# Altium project Multi_Interface_Hub_Pro_v1.0.PrjPcb (part 3 of 3)

## Sheet Gbe_Ethernet.SchDoc
size A3; SheetNumber: 1; SheetTotal: 4
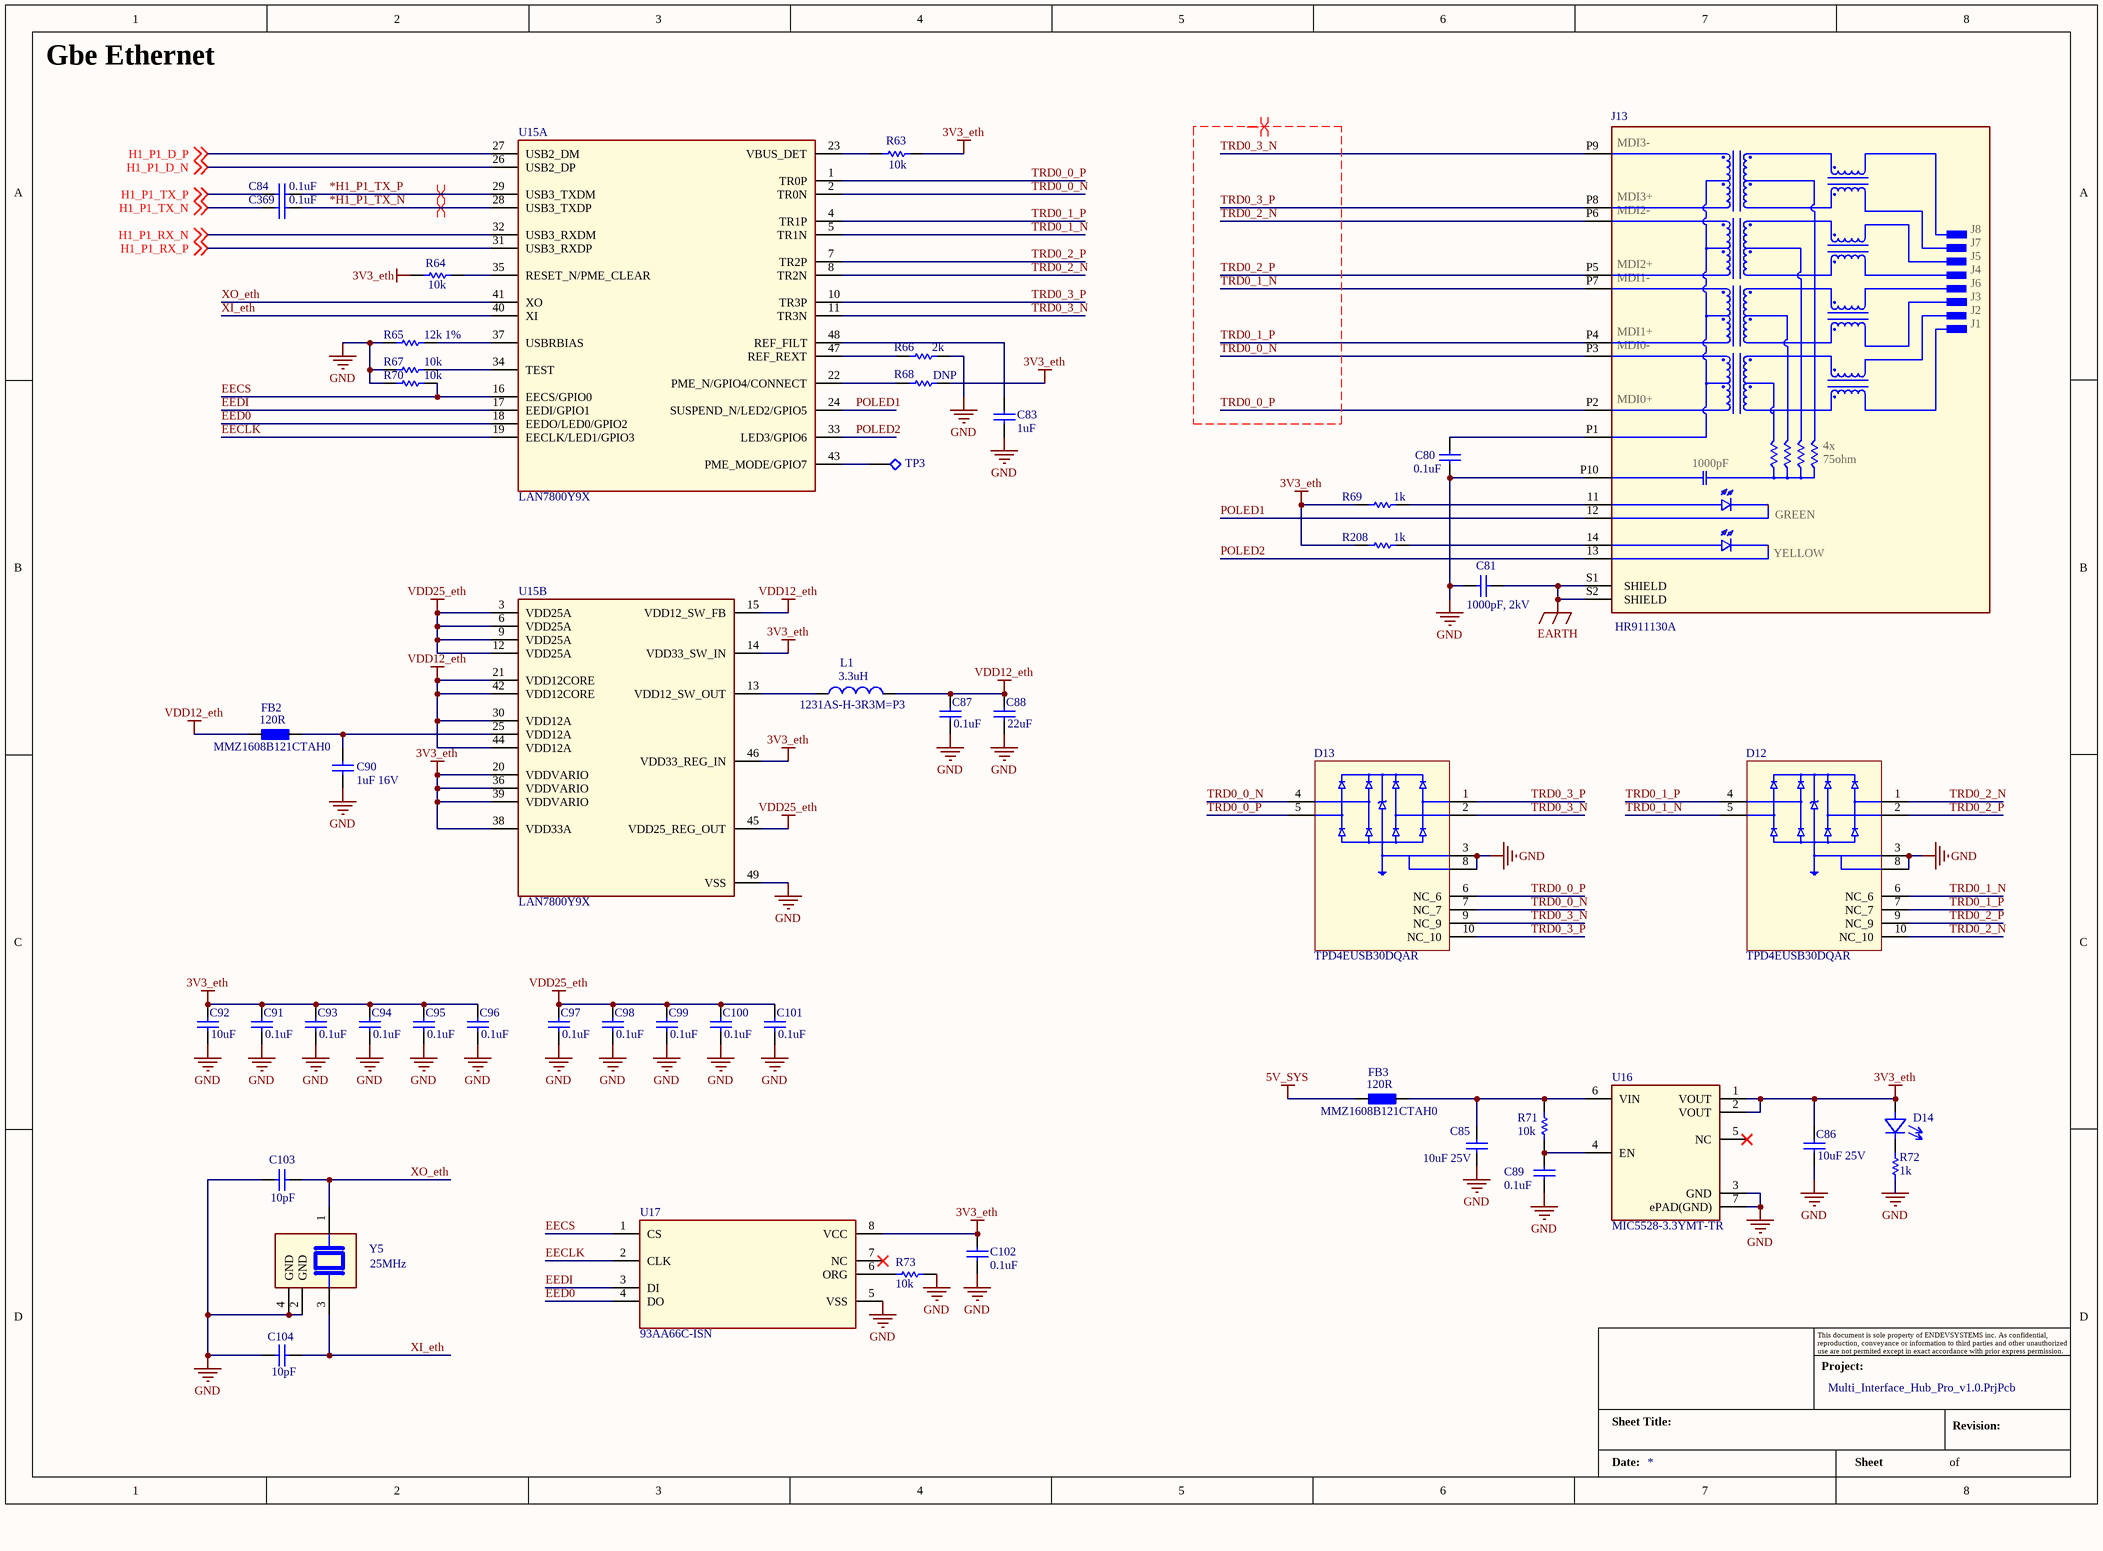
[diagram p10: Gbe_Ethernet.SchDoc]

### Parts
(Parts that share a designator on the sheet are numbered #1, #2 ... from top to bottom, then left to right.)
?#11  Project:: Multi_Interface_Hub_Pro_v1.0.PrjPcb  (hidden comment: Title_Block)  (graphical)
C80  0.1uF  [C-0402/1005]
C81  value 1000pF, 2kV  [C-0402/1005]  (hidden comment: 0.1uF)
C83  1uF  [C-0402/1005]
C84  0.1uF  [C-0402/1005]
C85  value 10uF 25V  [C-0402/1005]  (hidden comment: 0.1uF)
C86  value 10uF 25V  [C-0402/1005]  (hidden comment: 0.1uF)
C87  0.1uF  [C-0402/1005]
C88  22uF  [C-0402/1005]
C89  0.1uF  [C-0402/1005]
C90  1uF 16V  [C-0402/1005]
C91  0.1uF  [C-0402/1005]
C92  value 10uF  [C-0402/1005]  (hidden comment: 10uF 25V)
C93  0.1uF  [C-0402/1005]
C94  0.1uF  [C-0402/1005]
C95  0.1uF  [C-0402/1005]
C96  0.1uF  [C-0402/1005]
C97  0.1uF  [C-0402/1005]
C98  0.1uF  [C-0402/1005]
C99  0.1uF  [C-0402/1005]
C100  0.1uF  [C-0402/1005]
C101  0.1uF  [C-0402/1005]
C102  0.1uF  [C-0402/1005]
C103  10pF  [R-0402/1005]
C104  10pF  [R-0402/1005]
C369  0.1uF  [C-0402/1005]
D12  TPD4EUSB30DQAR  [IC_TPD4EUSB30DQAR]
D13  TPD4EUSB30DQAR  [IC_TPD4EUSB30DQAR]
D14  BRIGHT GREEN  [LEDC1608X65N]  (value not drawn)
FB2  MMZ1608B121CTAH0  value 120R  [R-0603/1608]
FB3  MMZ1608B121CTAH0  value 120R  [R-0603/1608]
J13  HR911130A  [HANRUN_HR911130A]
L1  1231AS-H-3R3M=P3  value 3.3uH  [0402-A]
R63  10k  [R-0402/1005]
R64  10k  [R-0402/1005]
R65  12k 1%  [R-0402/1005]
R66  2k  [R-0402/1005]
R67  10k  [R-0402/1005]
R68  DNP  [R-0402/1005]
R69  1k  [R-0402/1005]
R70  10k  [R-0402/1005]
R71  10k  [R-0402/1005]
R72  1k  [R-0402/1005]
R73  10k  [R-0402/1005]
R208  1k  [R-0402/1005]
TP3  Test Points  [Test Point TH Round H0.9,D1.6]  (value not drawn)
U15  LAN7800Y9X  [SQFN48_7X7_Y9X_MCH]  (parts A,B of 2)
U16  MIC5528-3.3YMT-TR  [SON40P120X120X60-7N]
U17  93AA66C-ISN  [SOIC8-N_MC_MCH]
Y5  value 25MHz  [ECS-250-10-37B2]  (hidden comment: ECS-250-10-37B2-CKM-TR)

### Nets
3V3_eth: C86.2 C91.2 C92.2 C93.2 C94.2 C95.2 C96.2 C102.2 D14.A R63.1 R64.1 R68.1 R69.1 R208.1 U15.14(VDD33_SW_IN) U15.20(VDDVARIO) U15.36(VDDVARIO) U15.38(VDD33A) U15.39(VDDVARIO) U15.46(VDD33_REG_IN) U16.1(VOUT) U16.2(VOUT) U17.8(VCC)
5V_SYS: FB3.2
EARTH: C81.2 J13.S1(SHIELD) J13.S2(SHIELD)
GND: C80.2 C81.1 C83.2 C85.1 C86.1 C87.1 C88.1 C89.1 C90.2 C91.1 C92.1 C93.1 C94.1 C95.1 C96.1 C97.1 C98.1 C99.1 C100.1 C101.1 C102.1 C103.2 C104.2 D12.3(GND_3) D12.8(GND_8) D13.3(GND_3) D13.8(GND_8) J13.P10 R65.2 R66.1 R67.2 R70.2 R72.2 R73.2 U15.49(VSS) U16.3(GND) U16.7(ePAD(GND)) U17.5(VSS) Y5.2(GND) Y5.4(GND)
VDD12_eth: C87.2 C88.2 FB2.2 L1.2 U15.15(VDD12_SW_FB) U15.21(VDD12CORE) U15.30(VDD12A) U15.42(VDD12CORE) U15.44(VDD12A)
VDD25_eth: C97.2 C98.2 C99.2 C100.2 C101.2 U15.3(VDD25A) U15.6(VDD25A) U15.9(VDD25A) U15.12(VDD25A) U15.45(VDD25_REG_OUT)
*H1_P1_TX_N: C369.1 U15.28(USB3_TXDP)
*H1_P1_TX_P: C84.1 U15.29(USB3_TXDM)
EECLK: U15.19(EECLK/LED1/GPIO3) U17.2(CLK)
EECS: R70.1 U15.16(EECS/GPIO0) U17.1(CS)
EED0: U15.18(EEDO/LED0/GPIO2) U17.4(DO)
EEDI: U15.17(EEDI/GPIO1) U17.3(DI)
H1_P1_D_N: U15.26(USB2_DP) ; off-sheet H1_P1_D_N
H1_P1_D_P: U15.27(USB2_DM) ; off-sheet H1_P1_D_P
H1_P1_RX_N: U15.32(USB3_RXDM) ; off-sheet H1_P1_RX_N
H1_P1_RX_P: U15.31(USB3_RXDP) ; off-sheet H1_P1_RX_P
H1_P1_TX_N: C369.2 ; off-sheet H1_P1_TX_N
H1_P1_TX_P: C84.2 ; off-sheet H1_P1_TX_P
POLED1: J13.12 U15.24(SUSPEND_N/LED2/GPIO5)
POLED2: J13.13 U15.33(LED3/GPIO6)
TRD0_0_N: D13.4(D2+) D13.7(NC_7) J13.P3 U15.2(TR0N)
TRD0_0_P: D13.5(D2-) D13.6(NC_6) J13.P2 U15.1(TR0P)
TRD0_1_N: D12.5(D2-) D12.6(NC_6) J13.P7 U15.5(TR1N)
TRD0_1_P: D12.4(D2+) D12.7(NC_7) J13.P4 U15.4(TR1P)
TRD0_2_N: D12.1(D1+) D12.10(NC_10) J13.P6 U15.8(TR2N)
TRD0_2_P: D12.2(D1-) D12.9(NC_9) J13.P5 U15.7(TR2P)
TRD0_3_N: D13.2(D1-) D13.9(NC_9) J13.P9 U15.11(TR3N)
TRD0_3_P: D13.1(D1+) D13.10(NC_10) J13.P8 U15.10(TR3P)
XI_eth: C104.1 U15.40(XI) Y5.3
XO_eth: C103.1 U15.41(XO) Y5.1
NetC80_1: C80.1 J13.P1
NetC83_1: C83.1 U15.48(REF_FILT)
NetC85_2: C85.2 FB3.1 R71.1 U16.6(VIN)
NetC89_2: C89.2 R71.2 U16.4(EN)
NetC90_1: C90.1 FB2.1 U15.25(VDD12A)
NetJ13_11: J13.11 R69.2
NetJ13_14: J13.14 R208.2
NetL1_1: L1.1 U15.13(VDD12_SW_OUT)
NetR63_2: R63.2 U15.23(VBUS_DET)
NetR64_2: R64.2 U15.35(RESET_N/PME_CLEAR)
NetR65_1: R65.1 U15.37(USBRBIAS)
NetR66_2: R66.2 U15.47(REF_REXT)
NetR67_1: R67.1 U15.34(TEST)
NetR68_2: R68.2 U15.22(PME_N/GPIO4/CONNECT)
NetR73_1: R73.1 U17.6(ORG)
NetTP3_1: TP3.1 U15.43(PME_MODE/GPIO7)

Not connected (* = marked no-connect by the designer): D14 C; R72 1; U16 5(NC)*; U17 7(NC)*

### Layout directives
differential pair; differential pair class Diff_100R: TRD0_0_N, TRD0_0_P, TRD0_1_N, TRD0_1_P, TRD0_2_N, TRD0_2_P, TRD0_3_N, TRD0_3_P
differential pair; differential pair class Diff_90R: *H1_P1_TX_N, *H1_P1_TX_P

### Notes on the sheet
- Gbe Ethernet
- (in symbol Title_Block) This document is sole property of ENDEVSYSTEMS inc. As confidential, reproduction, conveyance or information to third parties and other unauthorized use are not permited except in exact accordance with prior express permission.; Project:; Sheet Title:; Revision:; Date:; Sheet; of

### Library data of the parts
C80 C81 C84-C87 C89-C91 C93-C102 C369 = Cap: Capacitor; Published: 8-Jun-2000; LatestRevisionDate: 17-Jul-2002; LatestRevisionNote: Re-released for DXP Platform.; PackageReference: RAD-0.3; Publisher: Altium Limited; PackageDescription: Radial Cap, Thru-Hole; 2 Leads; 0.3 in Pin Spacing
  C80 C84 C87 C89 C91 C93-C102 C369: Value: 0.1uF
  C90: Value: 1uF 16V
C83 = Cap: 1uF 16V; Published: 8-Jun-2000; LatestRevisionDate: 17-Jul-2002; LatestRevisionNote: Re-released for DXP Platform.; PackageReference: RAD-0.3; Publisher: Altium Limited; PackageDescription: Radial Cap, Thru-Hole; 2 Leads; 0.3 in Pin Spacing; Value: 1uF
C88 = Cap: 22uF 6.3V; Published: 8-Jun-2000; LatestRevisionDate: 17-Jul-2002; LatestRevisionNote: Re-released for DXP Platform.; PackageReference: RAD-0.3; Publisher: Altium Limited; PackageDescription: Radial Cap, Thru-Hole; 2 Leads; 0.3 in Pin Spacing; Value: 22uF
C92 = Cap: Published: 8-Jun-2000; LatestRevisionDate: 17-Jul-2002; LatestRevisionNote: Re-released for DXP Platform.; PackageReference: RAD-0.3; Publisher: Altium Limited; PackageDescription: Radial Cap, Thru-Hole; 2 Leads; 0.3 in Pin Spacing
C103 C104 = Cap: Capacitor; Value: 0.1uF; Published: 8-Jun-2000; LatestRevisionDate: 17-Jul-2002; LatestRevisionNote: Re-released for DXP Platform.; PackageReference: RAD-0.3; Publisher: Altium Limited; PackageDescription: Radial Cap, Thru-Hole; 2 Leads; 0.3 in Pin Spacing
D12 D13 = TPD4EUSB30DQAR: 4-channel ESD solution for SuperSpeed (6 Gbps) USB 3.0 interface 10-USON -40 to 85; Value: *; Package: None; MP: TPD4EUSB30DQAR; Price: None; Availability: Unavailable
D14 = Diode-LED: Supplier: Digikey Electronics
FB2 FB3 = BLM15H: FERRITE BEAD 120 OHM 0402 1LN; Mfr. Part No.: BLM15HB121SN1D; Unit Price (USD): 0.19; Supplier Part No.: 490-4000-1-ND; Supplier: Digikey Electronics
J13 = HR911130A: Check availability; GateName_1: G$1; MF: hanrun; SymbolName_1: HR911130A; LibraryName: HR911130A; DeviceSetName: HR911130A; AVAILABILITY: Not in stock; MP: HR911130A; PACKAGE: None; PRICE: None; YELLOW: YELLOW; GREEN: GREEN; 75ohm: 75ohm; 1000pF: 1000pF; 4x: 4x; MDI3-: MDI3-; MDI3+: MDI3+; MDI2-: MDI2-; MDI2+: MDI2+; MDI1-: MDI1-; MDI1+: MDI1+; MDI0-: MDI0-; MDI0+: MDI0+; J8: J8; J7: J7; J5: J5; J4: J4; J6: J6; J3: J3; J2: J2; J1: J1
L1 = Inductor: Code_IEC: 1005; Published: 8-Jun-2000; LatestRevisionDate: 29-May-2009; LatestRevisionNote: IPC-7351 Footprint Added.; PackageReference: 0402-A; Publisher: Altium Limited; PackageDescription: Chip Inductor; Code_JEITA: 0402
R63 R64 R71 R73 = Res1: Resistor; Published: 8-Jun-2000; LatestRevisionDate: 17-Jul-2002; LatestRevisionNote: Re-released for DXP Platform.; PackageReference: AXIAL-0.3; Publisher: Altium Limited; PackageDescription: Axial Device, Thru-Hole; 2 Leads; 0.3 in Pin Spacing; Value: 10K
R65 R67 R70 = Res1: Resistor; Value: 200K; Published: 8-Jun-2000; LatestRevisionDate: 17-Jul-2002; LatestRevisionNote: Re-released for DXP Platform.; PackageReference: AXIAL-0.3; Publisher: Altium Limited; PackageDescription: Axial Device, Thru-Hole; 2 Leads; 0.3 in Pin Spacing
R66 R68 R69 R72 R208 = Res1: Resistor; Value: 10K; Published: 8-Jun-2000; LatestRevisionDate: 17-Jul-2002; LatestRevisionNote: Re-released for DXP Platform.; PackageReference: AXIAL-0.3; Publisher: Altium Limited; PackageDescription: Axial Device, Thru-Hole; 2 Leads; 0.3 in Pin Spacing
U15 = LAN7800Y9X: Ethernet Controller 10/100/1000 Base-TX PHY - Interface 48-SQFN (7x7); Mfr_Name: Microchip; RefDes: RefDes; Type: Type
U16 = MIC5528-3.3YMT-TR: IC REG LINEAR 3.3V 500MA 6TDFN; MF: Microchip; Package: TDFN-6 Microchip; MP: MIC5528-3.3YMT-TR; Value: *; SnapEDA_Link: https://www.snapeda.com/parts/MIC5528-3.3YMT-TR/Microchip/view-part/587087/?ref=snap; Price: None; Availability: Unavailable
U17 = 93AA66C-ISN: Microwire Serial EEPROM Family, 1.8 to 5.5V, 3 MHz, -40°Cto 125°C, SOIC-8, RoHS; Mfr_Name: Microchip; RefDes: RefDes; Type: Type
?#11 = Title_Block: Date:: *

## Sheet Audio_Codec.SchDoc
size A3; SheetNumber: 1; SheetTotal: 4
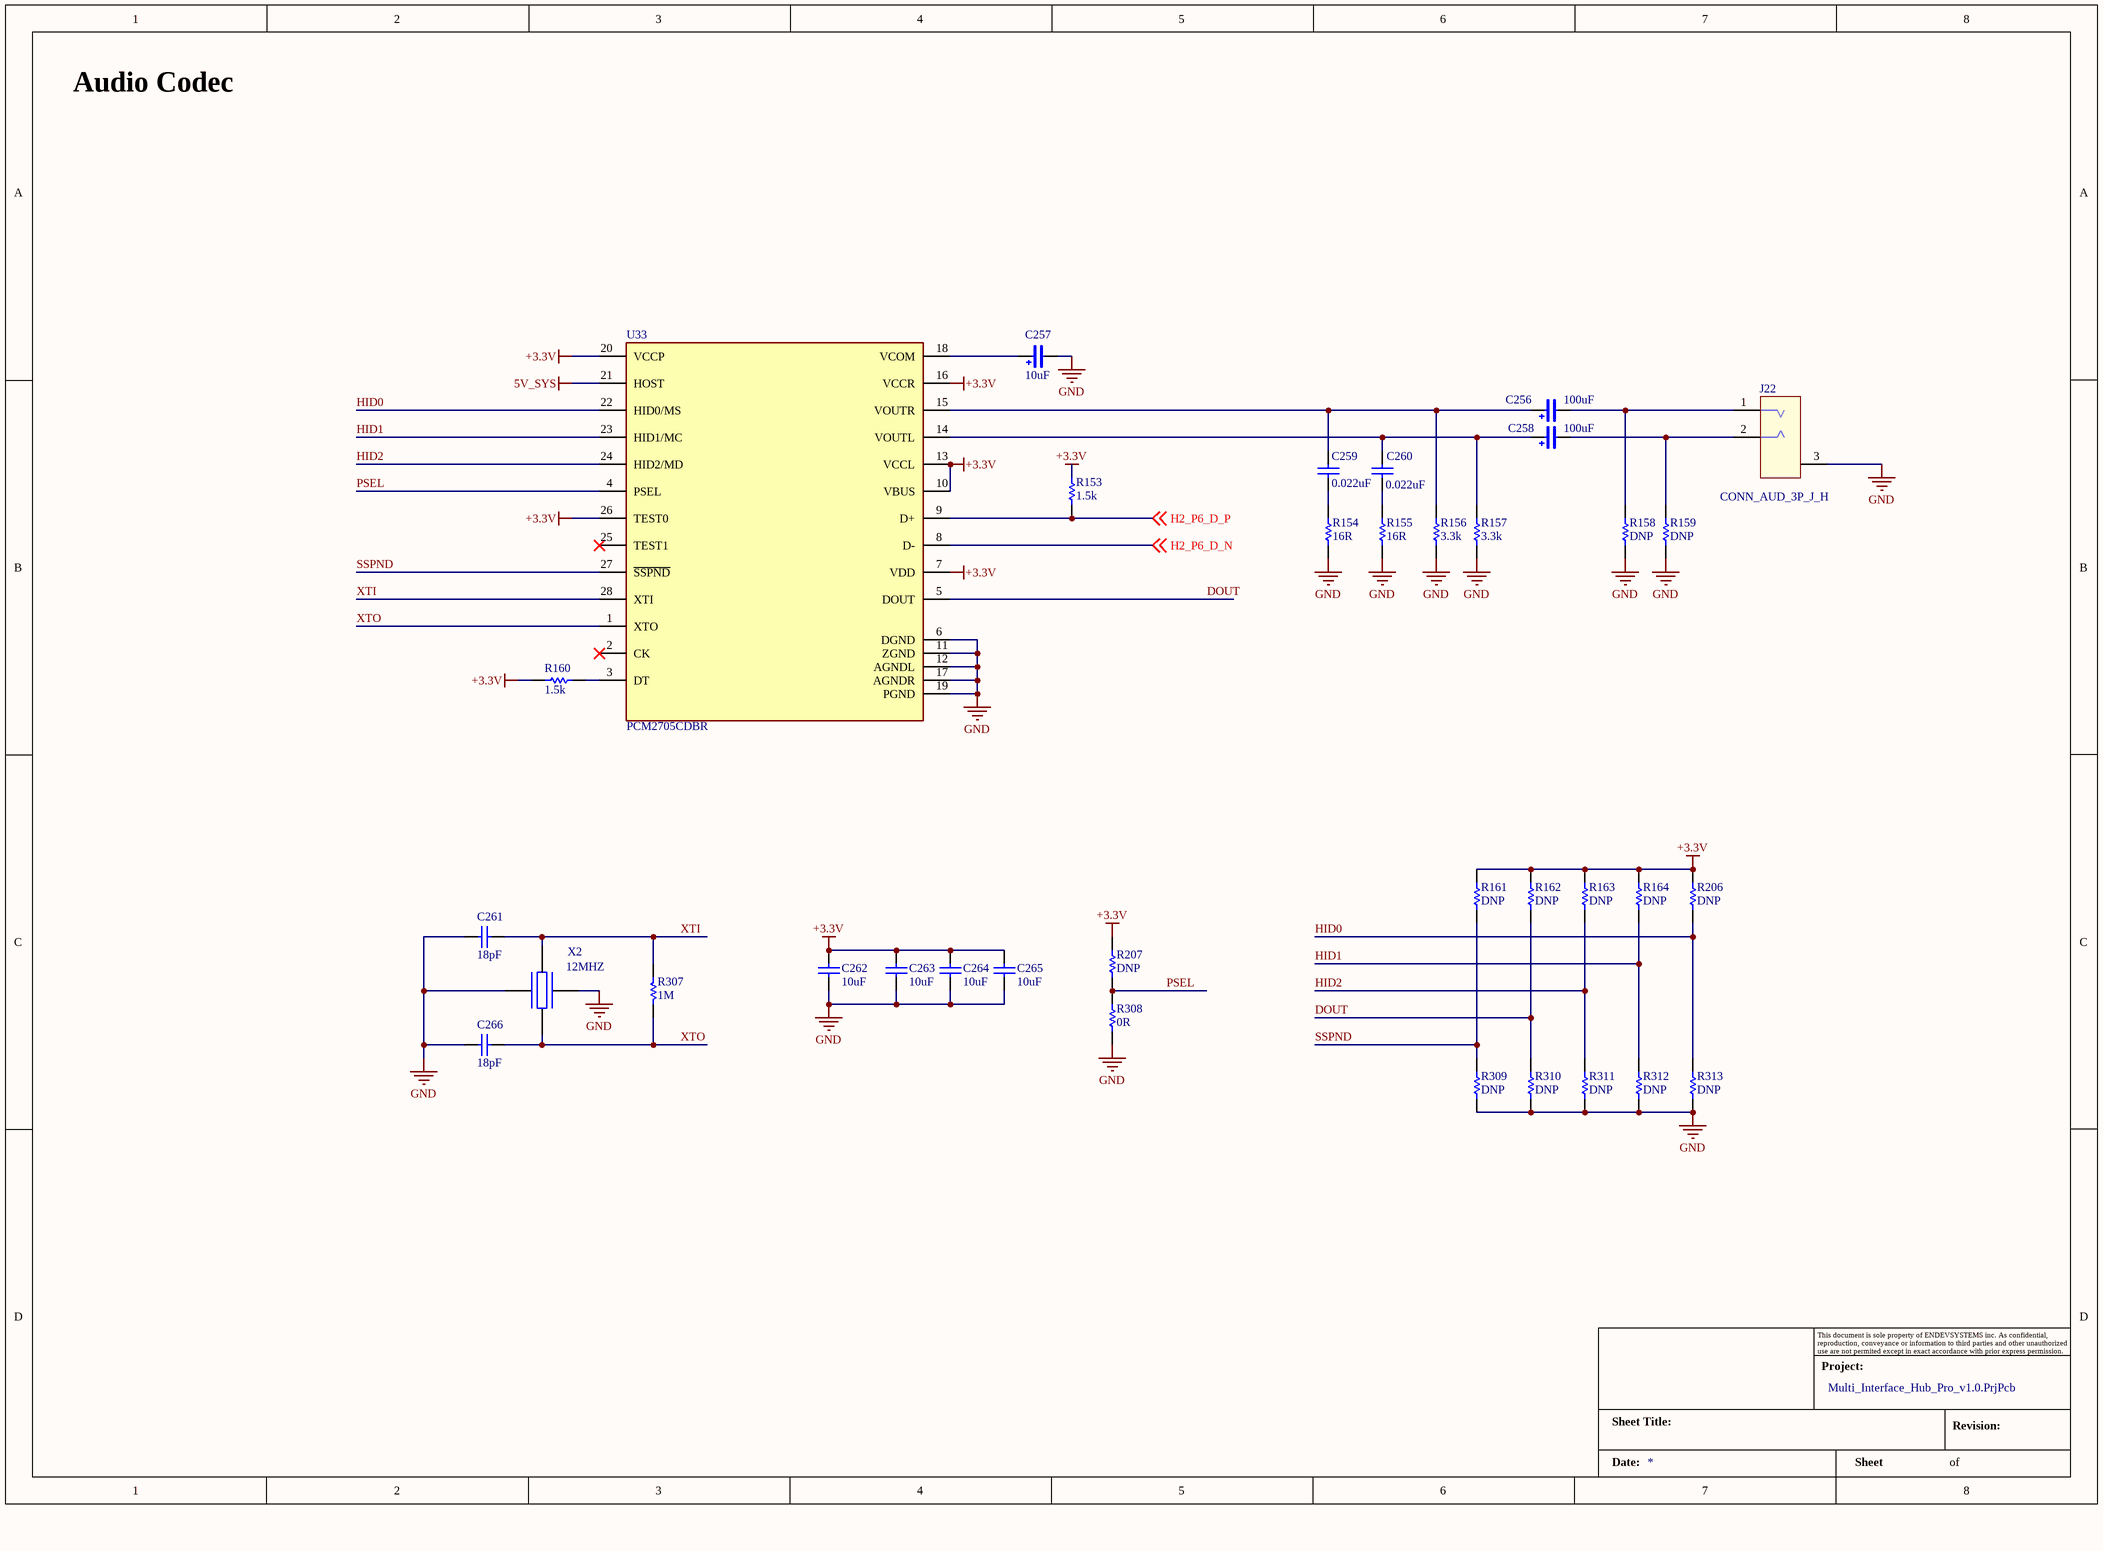
[diagram p11: Audio_Codec.SchDoc]

### Parts
(Parts that share a designator on the sheet are numbered #1, #2 ... from top to bottom, then left to right.)
?#12  Project:: Multi_Interface_Hub_Pro_v1.0.PrjPcb  (hidden comment: Title_Block)  (graphical)
C256  100uF  [C-1206 (Tantalum)]
C257  10uF  [C-1206 (Tantalum)]
C258  100uF  [C-1206 (Tantalum)]
C259  0.022uF  [CAP 1206/3216]
C260  0.022uF  [CAP 1206/3216]
C261  18pF  [CAP 1206/3216]
C262  10uF  [CAP 1206/3216]
C263  10uF  [CAP 1206/3216]
C264  10uF  [CAP 1206/3216]
C265  10uF  [CAP 1206/3216]
C266  18pF  [CAP 1206/3216]
J22  CONN_AUD_3P_J_H
R153  1.5k  [R-0402]
R154  16R  [R-0402]
R155  16R  [R-0402]
R156  3.3k  [R-0402]
R157  3.3k  [R-0402]
R158  DNP  [R-0402]
R159  DNP  [R-0402]
R160  1.5k  [R-0402]
R161  DNP  [R-0402]
R162  DNP  [R-0402]
R163  DNP  [R-0402]
R164  DNP  [R-0402]
R206  DNP  [R-0402]
R207  DNP  [R-0402]
R307  1M  [R-0402]
R308  0R  [R-0402]
R309  DNP  [R-0402]
R310  DNP  [R-0402]
R311  DNP  [R-0402]
R312  DNP  [R-0402]
R313  DNP  [R-0402]
U33  PCM2705CDBR  [SOP65P780X200-28N]
X2  12MHZ

### Nets
5V_SYS: U33.21(HOST)
+3.3V: C262.2 C263.2 C264.2 C265.2 R153.1 R160.1 R161.1 R162.1 R163.1 R164.1 R206.1 R207.1 U33.7(VDD) U33.10(VBUS) U33.13(VCCL) U33.16(VCCR) U33.20(VCCP) U33.26(TEST0)
GND: C257.- C261.2 C262.2 C263.2 C264.2 C265.2 C266.2 J22.3 R154.2 R155.2 R156.2 R157.2 R158.2 R159.2 R308.2 R309.1 R310.1 R311.1 R312.1 R313.1 U33.6(DGND) U33.11(ZGND) U33.12(AGNDL) U33.17(AGNDR) U33.19(PGND) X2.1(IN/OUT) X2.3(OUT/IN)
DOUT: R162.2 R310.2 U33.5(DOUT)
H2_P6_D_N: U33.8(D-) ; off-sheet H2_P6_D_N
H2_P6_D_P: R153.2 U33.9(D+) ; off-sheet H2_P6_D_P
HID0: R206.2 R313.2 U33.22(HID0/MS)
HID1: R164.2 R312.2 U33.23(HID1/MC)
HID2: R163.2 R311.2 U33.24(HID2/MD)
PSEL: R207.2 R308.1 U33.4(PSEL)
SSPND: R161.2 R309.2 U33.27(~{SSPND})
XTI: C261.2 R307.2 U33.28(XTI) X2.1(IN/OUT)
XTO: C266.2 R307.1 U33.1(XTO) X2.2(GND)
NetC256_+: C256.+ C259.2 R156.1 U33.15(VOUTR)
NetC256_-: C256.- J22.1 R158.1
NetC257_+: C257.+ U33.18(VCOM)
NetC258_+: C258.+ C260.2 R157.1 U33.14(VOUTL)
NetC258_-: C258.- J22.2 R159.1
NetC259_2: C259.2 R154.1
NetC260_2: C260.2 R155.1
NetR160_2: R160.2 U33.3(DT)

Not connected (* = marked no-connect by the designer): U33 2(CK)* 25(TEST1)*

### Notes on the sheet
- Audio Codec
- (in symbol Title_Block) This document is sole property of ENDEVSYSTEMS inc. As confidential, reproduction, conveyance or information to third parties and other unauthorized use are not permited except in exact accordance with prior express permission.; Project:; Sheet Title:; Revision:; Date:; Sheet; of

### Library data of the parts
C256-C258 = Capacitor-Polar: CAP TANT 10UF 10% 16V 1206; Mfr. Part No.: F931C106KAAAJ6; Unit Price (USD): 0.67; Value: 10uF 16V; Supplier Part No.: 478-10723-1-ND; Supplier: Digikey Electronics
C259-C266 = CAP 1206/3216: CAP CER 10UF 25V X5R 1206; Mfr. Part No.: C1206C106M3PACTU; Unit Price (USD): 0.28; Supplier Part No.: 399-8153-1-ND; Supplier: Digikey Electronics
R153-R164 R206 R207 R307-R313 = Resistor: RES SMD 51 OHM 0.5% 1/16W 0402; Mfr. Part No.: ERA-2AED510X; Value: 51R; Unit Price (USD): 0.21; Supplier Part No.: P51DECT-ND; Supplier: Digikey Electronics
U33 = PCM2705CDBR: 98dB SNR Stereo Full Speed DAC with line-out and S/PDIF output, Bus/Self-powered (S/W Control); MF: Texas Instruments; SnapEDA_Link: https://www.snapeda.com/parts/PCM2705CDBR/Texas+Instruments/view-part/?ref=snap; Package: SSOP-28 Texas Instruments; Value: *; MP: PCM2705CDBR; Check_prices: https://www.snapeda.com/parts/PCM2705CDBR/Texas+Instruments/view-part/?ref=eda
X2 = Crystal-4SMD: Mfr. Part No.: LIS2DHTR; Supplier: DigikeyElectronics
?#12 = Title_Block: Date:: *

## Sheet InputPower.SchDoc
size A3; SheetNumber: 1; SheetTotal: 4
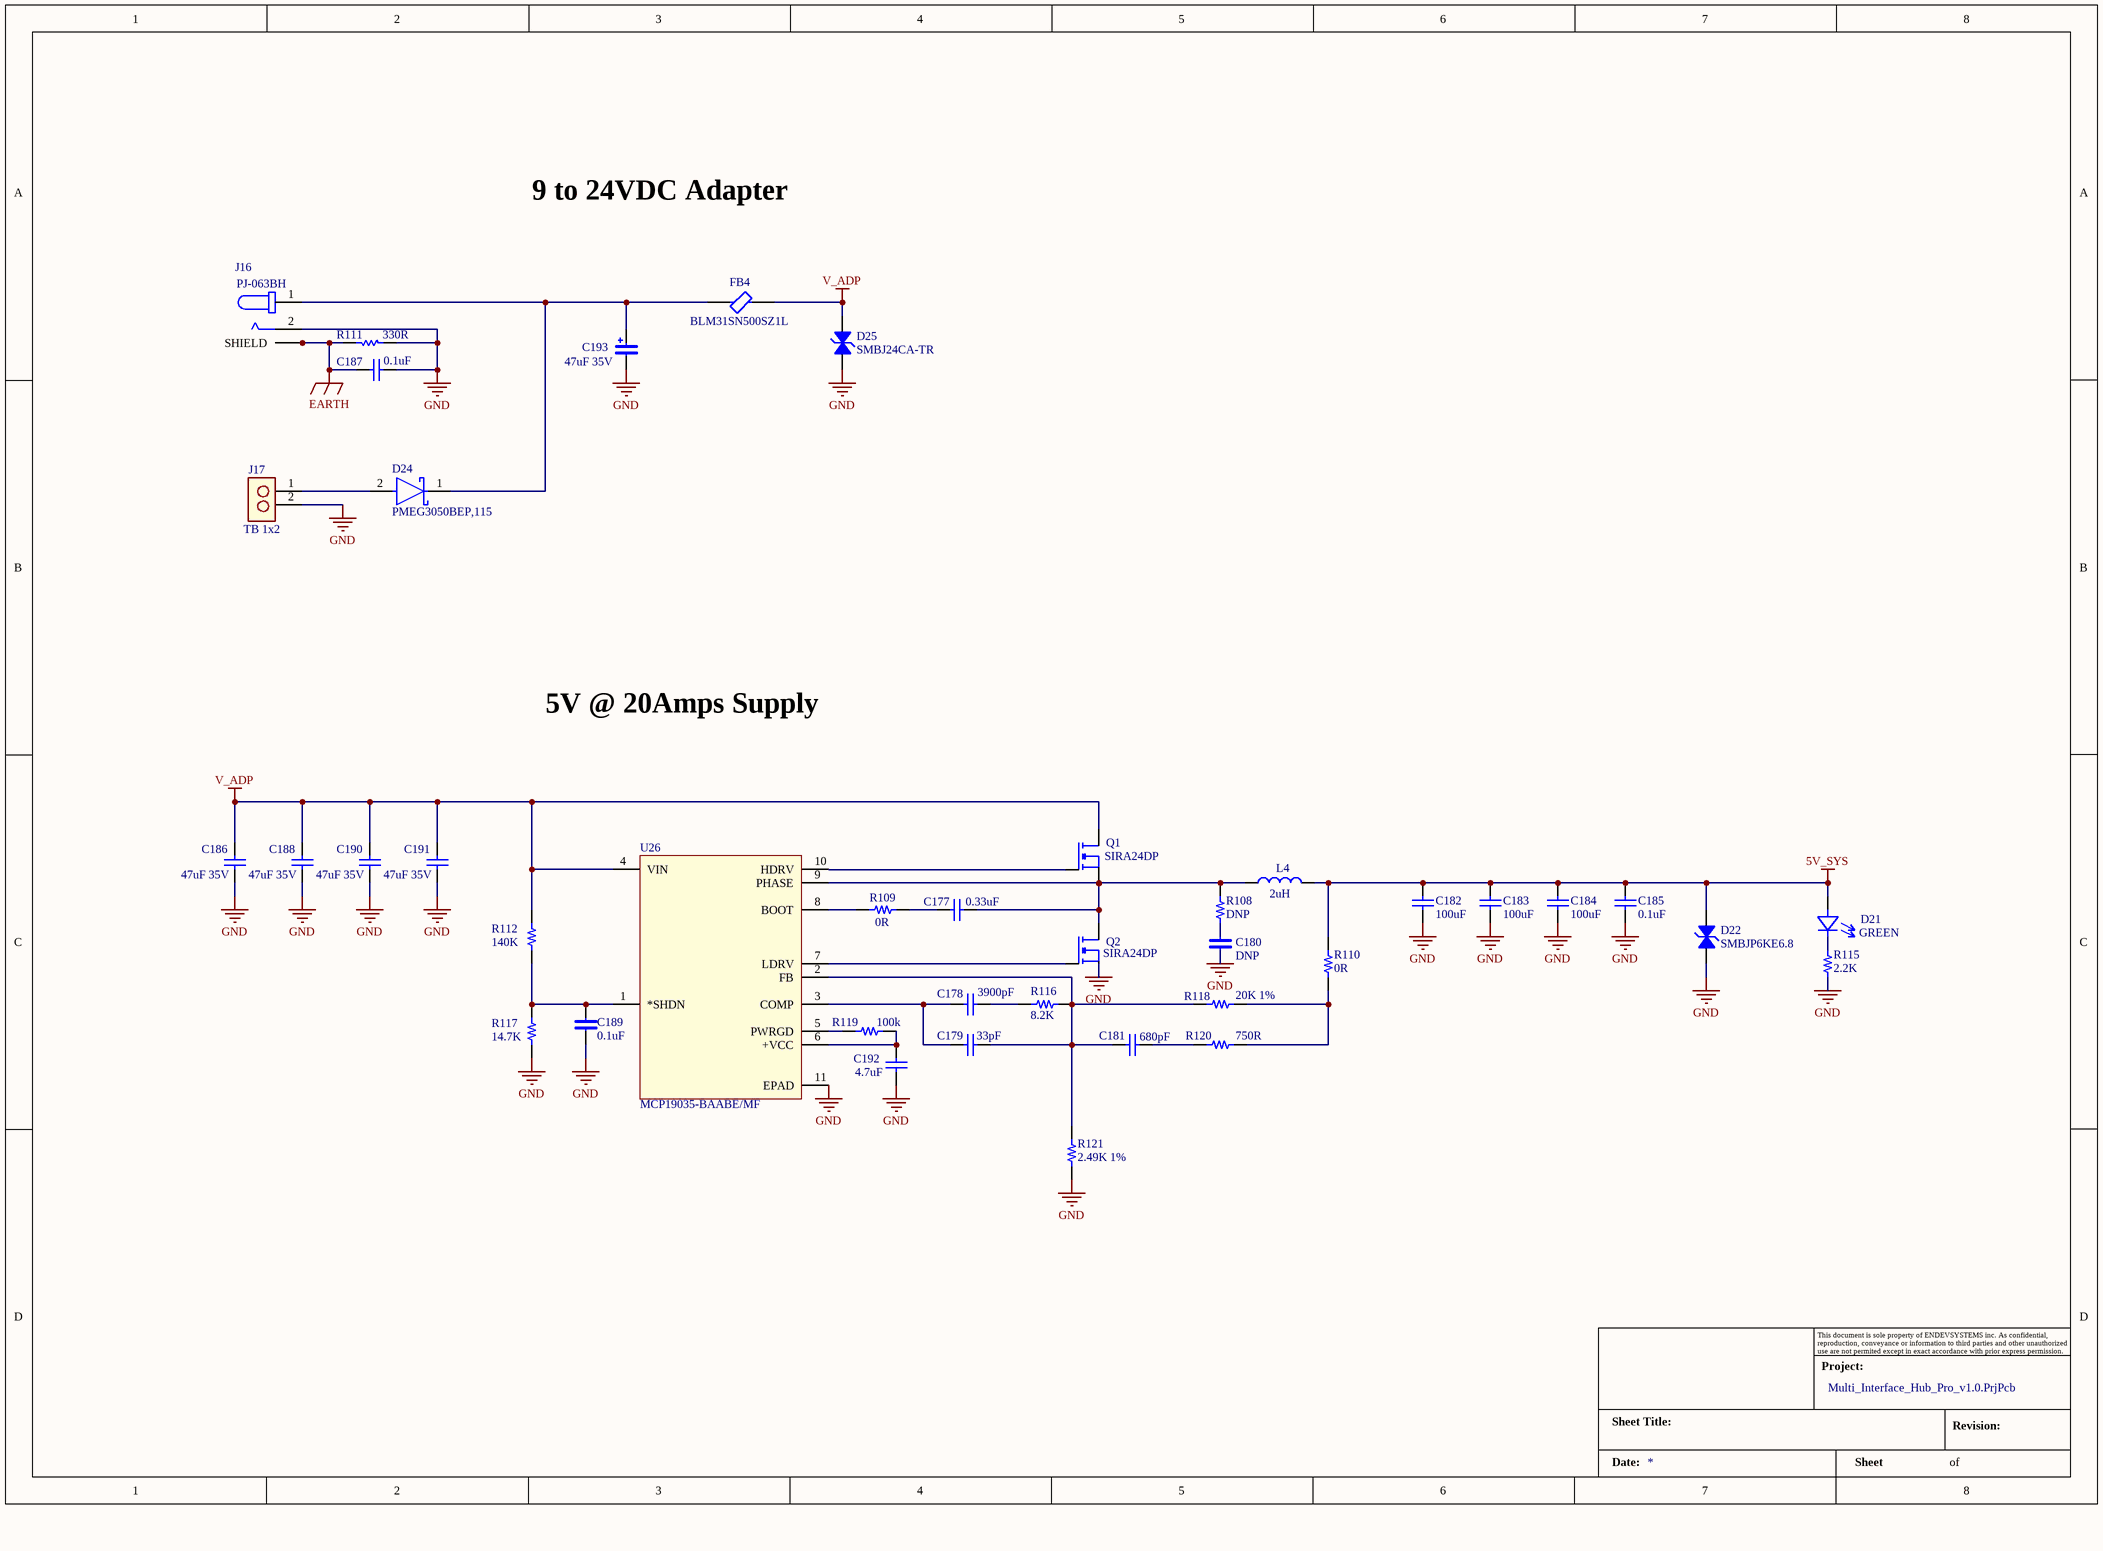
[diagram p12: InputPower.SchDoc]

### Parts
(Parts that share a designator on the sheet are numbered #1, #2 ... from top to bottom, then left to right.)
?#13  Project:: Multi_Interface_Hub_Pro_v1.0.PrjPcb  (hidden comment: Title_Block)  (graphical)
C177  0.33uF  [C-0805/2012]
C178  3900pF  [C-0805/2012]
C179  33pF  [C-0805/2012]
C180  DNP  [CAP 1206/3216]
C181  680pF  [C-0805/2012]
C182  100uF  [C-0805/2012]
C183  100uF  [C-0805/2012]
C184  100uF  [C-0805/2012]
C185  0.1uF  [C-0805/2012]
C186  47uF 35V  [C-0805/2012]
C187  0.1uF  [C-0603/1608]
C188  47uF 35V  [C-0805/2012]
C189  0.1uF  [CAP 1206/3216]
C190  47uF 35V  [C-0805/2012]
C191  47uF 35V  [C-0805/2012]
C192  4.7uF  [C-0805/2012]
C193  47uF 35V  [C-1206 (Tantalum)]
D21  GREEN  [SOIC-8 (W3.9mm) B]
D22  SMBJP6KE6.8  [DO-214AA\SMB]
D24  PMEG3050BEP,115  [FP-SOD128-MFG]
D25  SMBJ24CA-TR  [DO-214AA\SMB]
FB4  BLM31SN500SZ1L  [FP-BLM31-0_2-t1_1-MFG]
J16  PJ-063BH  [CUI_PJ-063BH]
J17  TB 1x2  [Terminal Block-1x2-5.08mm]
L4  2uH  [4.3x4.3mm]
Q1  SIRA24DP
Q2  SIRA24DP
R108  DNP  [R-0402]
R109  0R  [R-0402]
R110  0R  [R-0402]
R111  330R  [R-0603/1608]
R112  140K  [R-0402]
R115  2.2K  [R-0402]
R116  8.2K  [R-0402]
R117  14.7K  [R-0402]
R118  20K 1%  [R-0402]
R119  100k  [R-0402]
R120  750R  [R-0402]
R121  2.49K 1%  [R-0402]
U26  MCP19035-BAABE/MF  [DFN10_3x3MC_MCH]

### Nets
5V_SYS: C182.1 C183.1 C184.1 C185.1 D21.A D22.2 L4.2 R110.2
EARTH: C187.2 J16.S1(SHIELD) J16.S2(SH) R111.2
GND: C180.1 C182.2 C183.2 C184.2 C185.2 C186.1 C187.1 C188.1 C189.1 C190.1 C191.1 C192.2 C193.- D22.1 D25.1 J16.2 J17.2 Q2.2(S) R111.1 R115.1 R117.2 R121.1 U26.11(EPAD)
V_ADP: C186.2 C188.2 C190.2 C191.2 D25.2 FB4.2 Q1.3(D) R112.1 U26.4(VIN)
NetC177_1: C177.1 L4.1 Q1.2(S) Q2.3(D) R108.1 U26.9(PHASE)
NetC177_2: C177.2 R109.2
NetC178_1: C178.1 R116.1
NetC178_2: C178.2 C179.2 U26.3(COMP)
NetC179_1: C179.1 C181.2 R116.2 R118.1 R121.2 U26.2(FB)
NetC180_2: C180.2 R108.2
NetC181_1: C181.1 R120.1
NetC189_2: C189.2 R112.2 R117.1 U26.1(*SHDN)
NetC192_1: C192.1 R119.2 U26.6(+VCC)
NetC193_+: C193.+ D24.1(C) FB4.1 J16.1
NetD21_C: D21.C R115.2
NetD24_2: D24.2(A) J17.1
NetQ1_1: Q1.1(G) U26.10(HDRV)
NetQ2_1: Q2.1(G) U26.7(LDRV)
NetR109_1: R109.1 U26.8(BOOT)
NetR110_1: R110.1 R118.2 R120.2
NetR119_1: R119.1 U26.5(PWRGD)

### Notes on the sheet
- 9 to 24VDC Adapter
- 5V @ 20Amps Supply
- (in symbol Title_Block) This document is sole property of ENDEVSYSTEMS inc. As confidential, reproduction, conveyance or information to third parties and other unauthorized use are not permited except in exact accordance with prior express permission.; Project:; Sheet Title:; Revision:; Date:; Sheet; of

### Library data of the parts
C177-C179 C181-C184 C186 C188 C190-C192 = Cap: Capacitor; Value: 0.1uF; Published: 8-Jun-2000; LatestRevisionDate: 17-Jul-2002; LatestRevisionNote: Re-released for DXP Platform.; PackageReference: RAD-0.3; Publisher: Altium Limited; PackageDescription: Radial Cap, Thru-Hole; 2 Leads; 0.3 in Pin Spacing
C180 C189 = CAP 1206/3216: as C259 on sheet Audio_Codec; Supplier Part No.: 399-8153-1-ND; Supplier: Digikey Electronics
C185 C187 = Cap: Capacitor; Published: 8-Jun-2000; LatestRevisionDate: 17-Jul-2002; LatestRevisionNote: Re-released for DXP Platform.; PackageReference: RAD-0.3; Publisher: Altium Limited; PackageDescription: Radial Cap, Thru-Hole; 2 Leads; 0.3 in Pin Spacing; Value: 0.1uF
C193 = Capacitor-Polar: as C256 on sheet Audio_Codec; Supplier Part No.: 478-10723-1-ND; Supplier: Digikey Electronics
D21 = Diode-LED: Supplier: Digikey Electronics
D22 D25 = ACPDQC3V3T-HF: TVS DIODE 3.3V 9.8V 0402C; Unit Price (USD): 0.41; Mfr. Part No.: ACPDQC3V3T-HF; Supplier Part No.: 641-1635-1-ND; Supplier: Digikey Electronics
D24 = CMP-14398-000032-1: DIODE SCHOTTKY 30V 5A SOD128; RoHS Compliant: Yes
FB4 = CMP-06046-002359-1: Chip Ferrite Bead Array, 1206, 50Ω @ 100MHz, 0.0016Ω, ±12.5Ω, 12A; Number of Lines: 1; DC Resistance (DCR): 1.6mR; Max Current Rating: 12A; Case Code (Metric): 3216; Package Quantity: 3000; Height: 0.051inch; RoHS Compliant: Yes; Case/Package: 1206; Mount: Surface Mount; Case Code (Imperial): 1206; Width: 0.063inch; Length: 0.126inch; Max Operating Temperature: 125°C; Ratings: AEC-Q200; Packaging: Tape and Reel; Min Operating Temperature: -55°C
J16 = PJ-063BH: 2.5 mm Center Pin, 8.0 A, Right Angle, Through Hole, Shielded, Kinked Pins, Dc Power Jack Connector; Value: *; Price: None; MP: PJ-063BH; Availability: Unavailable; Package: None
J17 = T-BLOCK-1x2: Supplier: Digikey Electronics
L4 = 4.3x4.3mm: FIXED IND 22UH 620MA 350 MOHM; Mfr. Part No.: ASPI-4020S-220M-T; Unit Price (USD): 0.48; Supplier Part No.: 535-12307-1-ND; Value: 22uH; Supplier: Digikey Electronics
Q1 Q2 = MOSFET-N: Supplier: Digikey Electronics
R108-R110 R112 R115-R121 = Resistor: as R153 on sheet Audio_Codec; Supplier Part No.: P51DECT-ND; Supplier: Digikey Electronics
R111 = Res1: Resistor; Value: 10K; Published: 8-Jun-2000; LatestRevisionDate: 17-Jul-2002; LatestRevisionNote: Re-released for DXP Platform.; PackageReference: AXIAL-0.3; Publisher: Altium Limited; PackageDescription: Axial Device, Thru-Hole; 2 Leads; 0.3 in Pin Spacing
U26 = MCP19035-BAABEMF: No Description Available; Mfr_Name: Microchip; RefDes: RefDes; Type: Type
?#13 = Title_Block: Date:: *

## Nets that join several sheets
5V_SYS: USBC-US-100W-PD (R248.1), USB2.0_Hub (C55.2 C56.2 C57.2 U12.8), TypeA_3.1_Ports (22 pins), USBC_DS1_DS2 (16 pins), USBC_DS3_DS4 (16 pins), USBC-DS1-100W-PD (R293.1), PowerSwitch_DS2_DS3_DS4 (22 pins), Gbe_Ethernet (FB3.2), Audio_Codec (U33.21), InputPower (8 pins)
+1.2V: USBC_Hub1 (19 pins), USBC_Hub2 (19 pins)
+3.3V: USBC-US-Conn (C377.2 R223.2 U49.5), USBC-US-100W-PD (R169.1 R247.1 R249.2 R251.2), USBC_Hub1 (36 pins), USBC_Hub2 (36 pins), USB2.0_Hub (R49.1 R51.1 U11.7 U11.8), TypeA_3.1_Ports (14 pins), USBC_DS1_DS2 (6 pins), USBC_DS3_DS4 (6 pins), USBC-DS1-100W-PD (R281.1 R292.1 R294.2 R296.2), PowerSwitch_DS2_DS3_DS4 (R193.1 R203.1), Audio_Codec (18 pins)
DS1_PD_VBUS: USBC_DS1_DS2 (10 pins), USBC-DS1-100W-PD (C174.1 R285.1)
DS2-VBUS: USBC_DS1_DS2 (5 pins), PowerSwitch_DS2_DS3_DS4 (U31.4 U31.5)
DS3-VBUS: USBC_DS3_DS4 (5 pins), PowerSwitch_DS2_DS3_DS4 (U31.11 U31.12)
DS4-VBUS: USBC_DS3_DS4 (5 pins), PowerSwitch_DS2_DS3_DS4 (U32.4 U32.5)
EARTH: USBC-US-Conn (6 pins), USB2.0_Hub (23 pins), TypeA_3.1_Ports (12 pins), USBC_DS1_DS2 (12 pins), USBC_DS3_DS4 (12 pins), Gbe_Ethernet (C81.2 J13.S1 J13.S2), InputPower (C187.2 J16.S1 J16.S2 R111.2)
GND: USBC-US-Conn (31 pins), USBC-US-100W-PD (43 pins), USBC_Hub1 (48 pins), USBC_Hub2 (48 pins), USB2.0_Hub (53 pins), TypeA_3.1_Ports (52 pins), USBC_DS1_DS2 (48 pins), USBC_DS3_DS4 (46 pins), USBC-DS1-100W-PD (43 pins), PowerSwitch_DS2_DS3_DS4 (24 pins), Gbe_Ethernet (40 pins), Audio_Codec (27 pins), InputPower (23 pins)
US_PD_VBUS: USBC-US-Conn (11 pins), USBC-US-100W-PD (C150.1 R240.1)
V_ADP: USBC-US-100W-PD (7 pins), USBC-DS1-100W-PD (7 pins), InputPower (9 pins)
VBUS: USBC-US-Conn (7 pins), USBC_Hub1 (R2.2), USBC_Hub2 (R26.2)
VBUS-U-PD: USBC-US-Conn (Q4.3), USBC-US-100W-PD (9 pins)
H1_MI2C_CLK: USBC_Hub1 (R86.2 U1.61), TypeA_3.1_Ports (R77.1 R230.1), USBC_DS1_DS2 (R129.1)
H1_MI2C_DAT: USBC_Hub1 (R87.2 U1.3), TypeA_3.1_Ports (R79.1 R231.1), USBC_DS1_DS2 (R128.1)
H1_P1_D_N: USBC_Hub1 (U1.6), Gbe_Ethernet (U15.26)
H1_P1_D_P: USBC_Hub1 (U1.5), Gbe_Ethernet (U15.27)
H1_P1_RX_N: USBC_Hub1 (U1.11), Gbe_Ethernet (U15.32)
H1_P1_RX_P: USBC_Hub1 (U1.10), Gbe_Ethernet (U15.31)
H1_P1_TX_N: USBC_Hub1 (U1.8), Gbe_Ethernet (C369.2)
H1_P1_TX_P: USBC_Hub1 (U1.7), Gbe_Ethernet (C84.2)
H1_P2_D_N: USBC_Hub1 (U1.15), TypeA_3.1_Ports (J15.2)
H1_P2_D_P: USBC_Hub1 (U1.14), TypeA_3.1_Ports (J15.3)
H1_P2_RX_N: USBC_Hub1 (U1.20), TypeA_3.1_Ports (J15.5)
H1_P2_RX_P: USBC_Hub1 (U1.19), TypeA_3.1_Ports (J15.6)
H1_P2_TX_N: USBC_Hub1 (U1.17), TypeA_3.1_Ports (C111.2)
H1_P2_TX_P: USBC_Hub1 (U1.16), TypeA_3.1_Ports (C112.2)
H1_P3_D_N: USBC_Hub1 (U1.28), TypeA_3.1_Ports (J14.2)
H1_P3_D_P: USBC_Hub1 (U1.27), TypeA_3.1_Ports (J14.3)
H1_P3_RX_N: USBC_Hub1 (U1.33), TypeA_3.1_Ports (J14.5)
H1_P3_RX_P: USBC_Hub1 (U1.32), TypeA_3.1_Ports (J14.6)
H1_P3_TX_N: USBC_Hub1 (U1.30), TypeA_3.1_Ports (C118.2)
H1_P3_TX_P: USBC_Hub1 (U1.29), TypeA_3.1_Ports (C119.2)
H1_P4_D_N: USBC_Hub1 (U1.35), TypeA_3.1_Ports (J33.2)
H1_P4_D_P: USBC_Hub1 (U1.34), TypeA_3.1_Ports (J33.3)
H1_P4_RX_N: USBC_Hub1 (U1.40), TypeA_3.1_Ports (J33.5)
H1_P4_RX_P: USBC_Hub1 (U1.39), TypeA_3.1_Ports (J33.6)
H1_P4_TX_N: USBC_Hub1 (U1.37), TypeA_3.1_Ports (C371.2)
H1_P4_TX_P: USBC_Hub1 (U1.36), TypeA_3.1_Ports (C379.2)
H1_P5_D_N: USBC_Hub1 (U1.82), TypeA_3.1_Ports (J34.2)
H1_P5_D_P: USBC_Hub1 (U1.81), TypeA_3.1_Ports (J34.3)
H1_P5_RX_N: USBC_Hub1 (U1.87), TypeA_3.1_Ports (J34.5)
H1_P5_RX_P: USBC_Hub1 (U1.86), TypeA_3.1_Ports (J34.6)
H1_P5_TX_N: USBC_Hub1 (U1.83), TypeA_3.1_Ports (C383.2)
H1_P5_TX_P: USBC_Hub1 (U1.84), TypeA_3.1_Ports (C384.2)
H1_P6_D_N: USBC_Hub1 (U1.41), USB2.0_Hub (U12.30)
H1_P6_D_P: USBC_Hub1 (U1.42), USB2.0_Hub (U12.29)
H1_PF14: USBC_Hub1 (U1.57), TypeA_3.1_Ports (R229.1)
H1_PF15: USBC_Hub1 (U1.58), TypeA_3.1_Ports (R214.1)
H1_PF16: USBC_Hub1 (U1.59), TypeA_3.1_Ports (R82.1)
H1_PF17: USBC_Hub1 (U1.60), TypeA_3.1_Ports (R76.1)
H2_MI2C_CLK: USBC_Hub2 (R138.2 U6.61), USBC_DS1_DS2 (R144.1), USBC_DS3_DS4 (R188.1 R192.1), PowerSwitch_DS2_DS3_DS4 (R198.1 R302.1)
H2_MI2C_DAT: USBC_Hub2 (R137.2 U6.3), USBC_DS1_DS2 (R143.1), USBC_DS3_DS4 (R175.1 R187.1), PowerSwitch_DS2_DS3_DS4 (R199.1 R303.1)
H2_P1_D_N: USBC_Hub2 (U6.6), USBC_DS1_DS2 (D31.2 D31.9 J18.A7 J18.B7)
H2_P1_D_P: USBC_Hub2 (U6.5), USBC_DS1_DS2 (D31.1 D31.10 J18.A6 J18.B6)
H2_P1_RX_N: USBC_Hub2 (U6.11), USBC_DS1_DS2 (U27.10)
H2_P1_RX_P: USBC_Hub2 (U6.10), USBC_DS1_DS2 (U27.9)
H2_P1_TX_N: USBC_Hub2 (U6.8), USBC_DS1_DS2 (U27.7)
H2_P1_TX_P: USBC_Hub2 (U6.7), USBC_DS1_DS2 (U27.6)
H2_P2_D_N: USBC_Hub2 (U6.15), USBC_DS1_DS2 (D27.2 D27.9 J19.A7 J19.B7)
H2_P2_D_P: USBC_Hub2 (U6.14), USBC_DS1_DS2 (D27.1 D27.10 J19.A6 J19.B6)
H2_P2_RX_N: USBC_Hub2 (U6.20), USBC_DS1_DS2 (U28.10)
H2_P2_RX_P: USBC_Hub2 (U6.19), USBC_DS1_DS2 (U28.9)
H2_P2_TX_N: USBC_Hub2 (U6.17), USBC_DS1_DS2 (U28.7)
H2_P2_TX_P: USBC_Hub2 (U6.16), USBC_DS1_DS2 (U28.6)
H2_P3_D_N: USBC_Hub2 (U6.28), USBC_DS3_DS4 (D33.2 D33.9 J20.A7 J20.B7)
H2_P3_D_P: USBC_Hub2 (U6.27), USBC_DS3_DS4 (D33.1 D33.10 J20.A6 J20.B6)
H2_P3_RX_N: USBC_Hub2 (U6.33), USBC_DS3_DS4 (U29.10)
H2_P3_RX_P: USBC_Hub2 (U6.32), USBC_DS3_DS4 (U29.9)
H2_P3_TX_N: USBC_Hub2 (U6.30), USBC_DS3_DS4 (U29.7)
H2_P3_TX_P: USBC_Hub2 (U6.29), USBC_DS3_DS4 (U29.6)
H2_P4_D_N: USBC_Hub2 (U6.35), USBC_DS3_DS4 (D40.2 D40.9 J21.A7 J21.B7)
H2_P4_D_P: USBC_Hub2 (U6.34), USBC_DS3_DS4 (D40.1 D40.10 J21.A6 J21.B6)
H2_P4_RX_N: USBC_Hub2 (U6.40), USBC_DS3_DS4 (U30.10)
H2_P4_RX_P: USBC_Hub2 (U6.39), USBC_DS3_DS4 (U30.9)
H2_P4_TX_N: USBC_Hub2 (U6.37), USBC_DS3_DS4 (U30.7)
H2_P4_TX_P: USBC_Hub2 (U6.36), USBC_DS3_DS4 (U30.6)
H2_P6_D_N: USBC_Hub2 (U6.41), Audio_Codec (U33.8)
H2_P6_D_P: USBC_Hub2 (U6.42), Audio_Codec (R153.2 U33.9)
H2_PF15: USBC_Hub2 (U6.58), PowerSwitch_DS2_DS3_DS4 (R205.1)
H2_PF16: USBC_Hub2 (U6.59), PowerSwitch_DS2_DS3_DS4 (R197.1)
H2_PF17: USBC_Hub2 (U6.60), PowerSwitch_DS2_DS3_DS4 (R195.1)
I2C_MSTR_SCL: USBC-US-100W-PD (U20.10), USBC-DS1-100W-PD (U23.10)
I2C_MSTR_SDA: USBC-US-100W-PD (U20.9), USBC-DS1-100W-PD (U23.9)